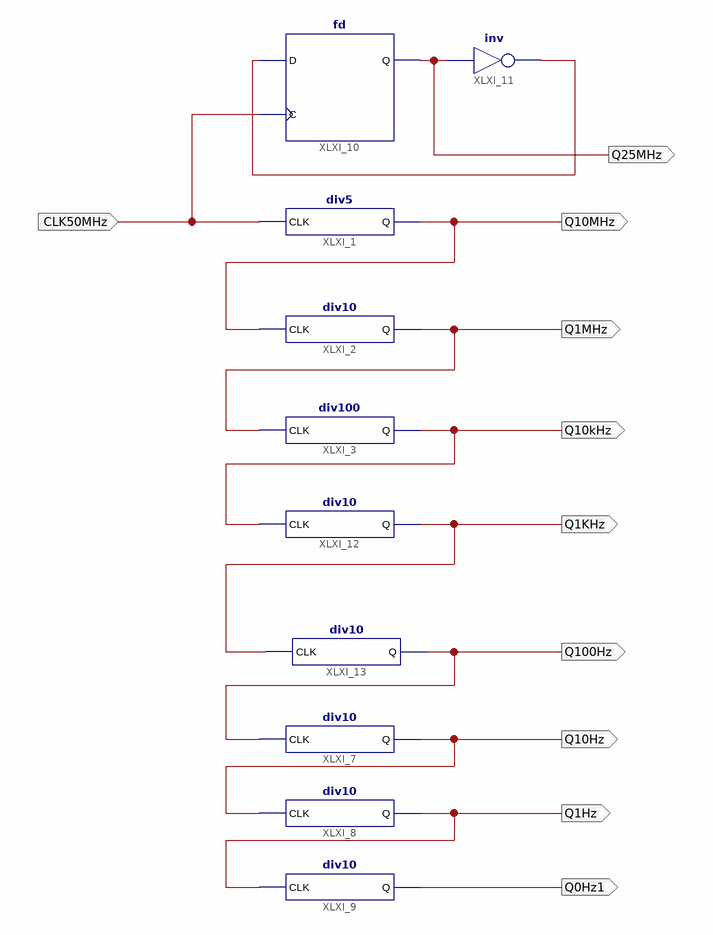
[diagram p0: schematic sheet 1]
// Xilinx ISE schematic div.sch (spartan3e) as structural Verilog: 10 symbols, 10 ports
module div (
  input  CLK50MHz,
  output Q10MHz,
  output Q1MHz,
  output Q10kHz,
  output Q25MHz,
  output Q100Hz,
  output Q10Hz,
  output Q1Hz,
  output Q0Hz1,
  output Q1KHz
);

  wire XLXN_3;

  div5 XLXI_1 (.CLK(CLK50MHz), .Q(Q10MHz));
  div10 XLXI_2 (.CLK(Q10MHz), .Q(Q1MHz));
  div100 XLXI_3 (.CLK(Q1MHz), .Q(Q10kHz));
  fd XLXI_10 (.C(CLK50MHz), .D(XLXN_3), .Q(Q25MHz));
  not XLXI_11 (XLXN_3, Q25MHz);
  div10 XLXI_12 (.CLK(Q10kHz), .Q(Q1KHz));
  div10 XLXI_13 (.CLK(Q1KHz), .Q(Q100Hz));
  div10 XLXI_7 (.CLK(Q100Hz), .Q(Q10Hz));
  div10 XLXI_8 (.CLK(Q10Hz), .Q(Q1Hz));
  div10 XLXI_9 (.CLK(Q1Hz), .Q(Q0Hz1));
endmodule
